# EAGLE design GPRS(A7) (EAGLE 7.6.0)
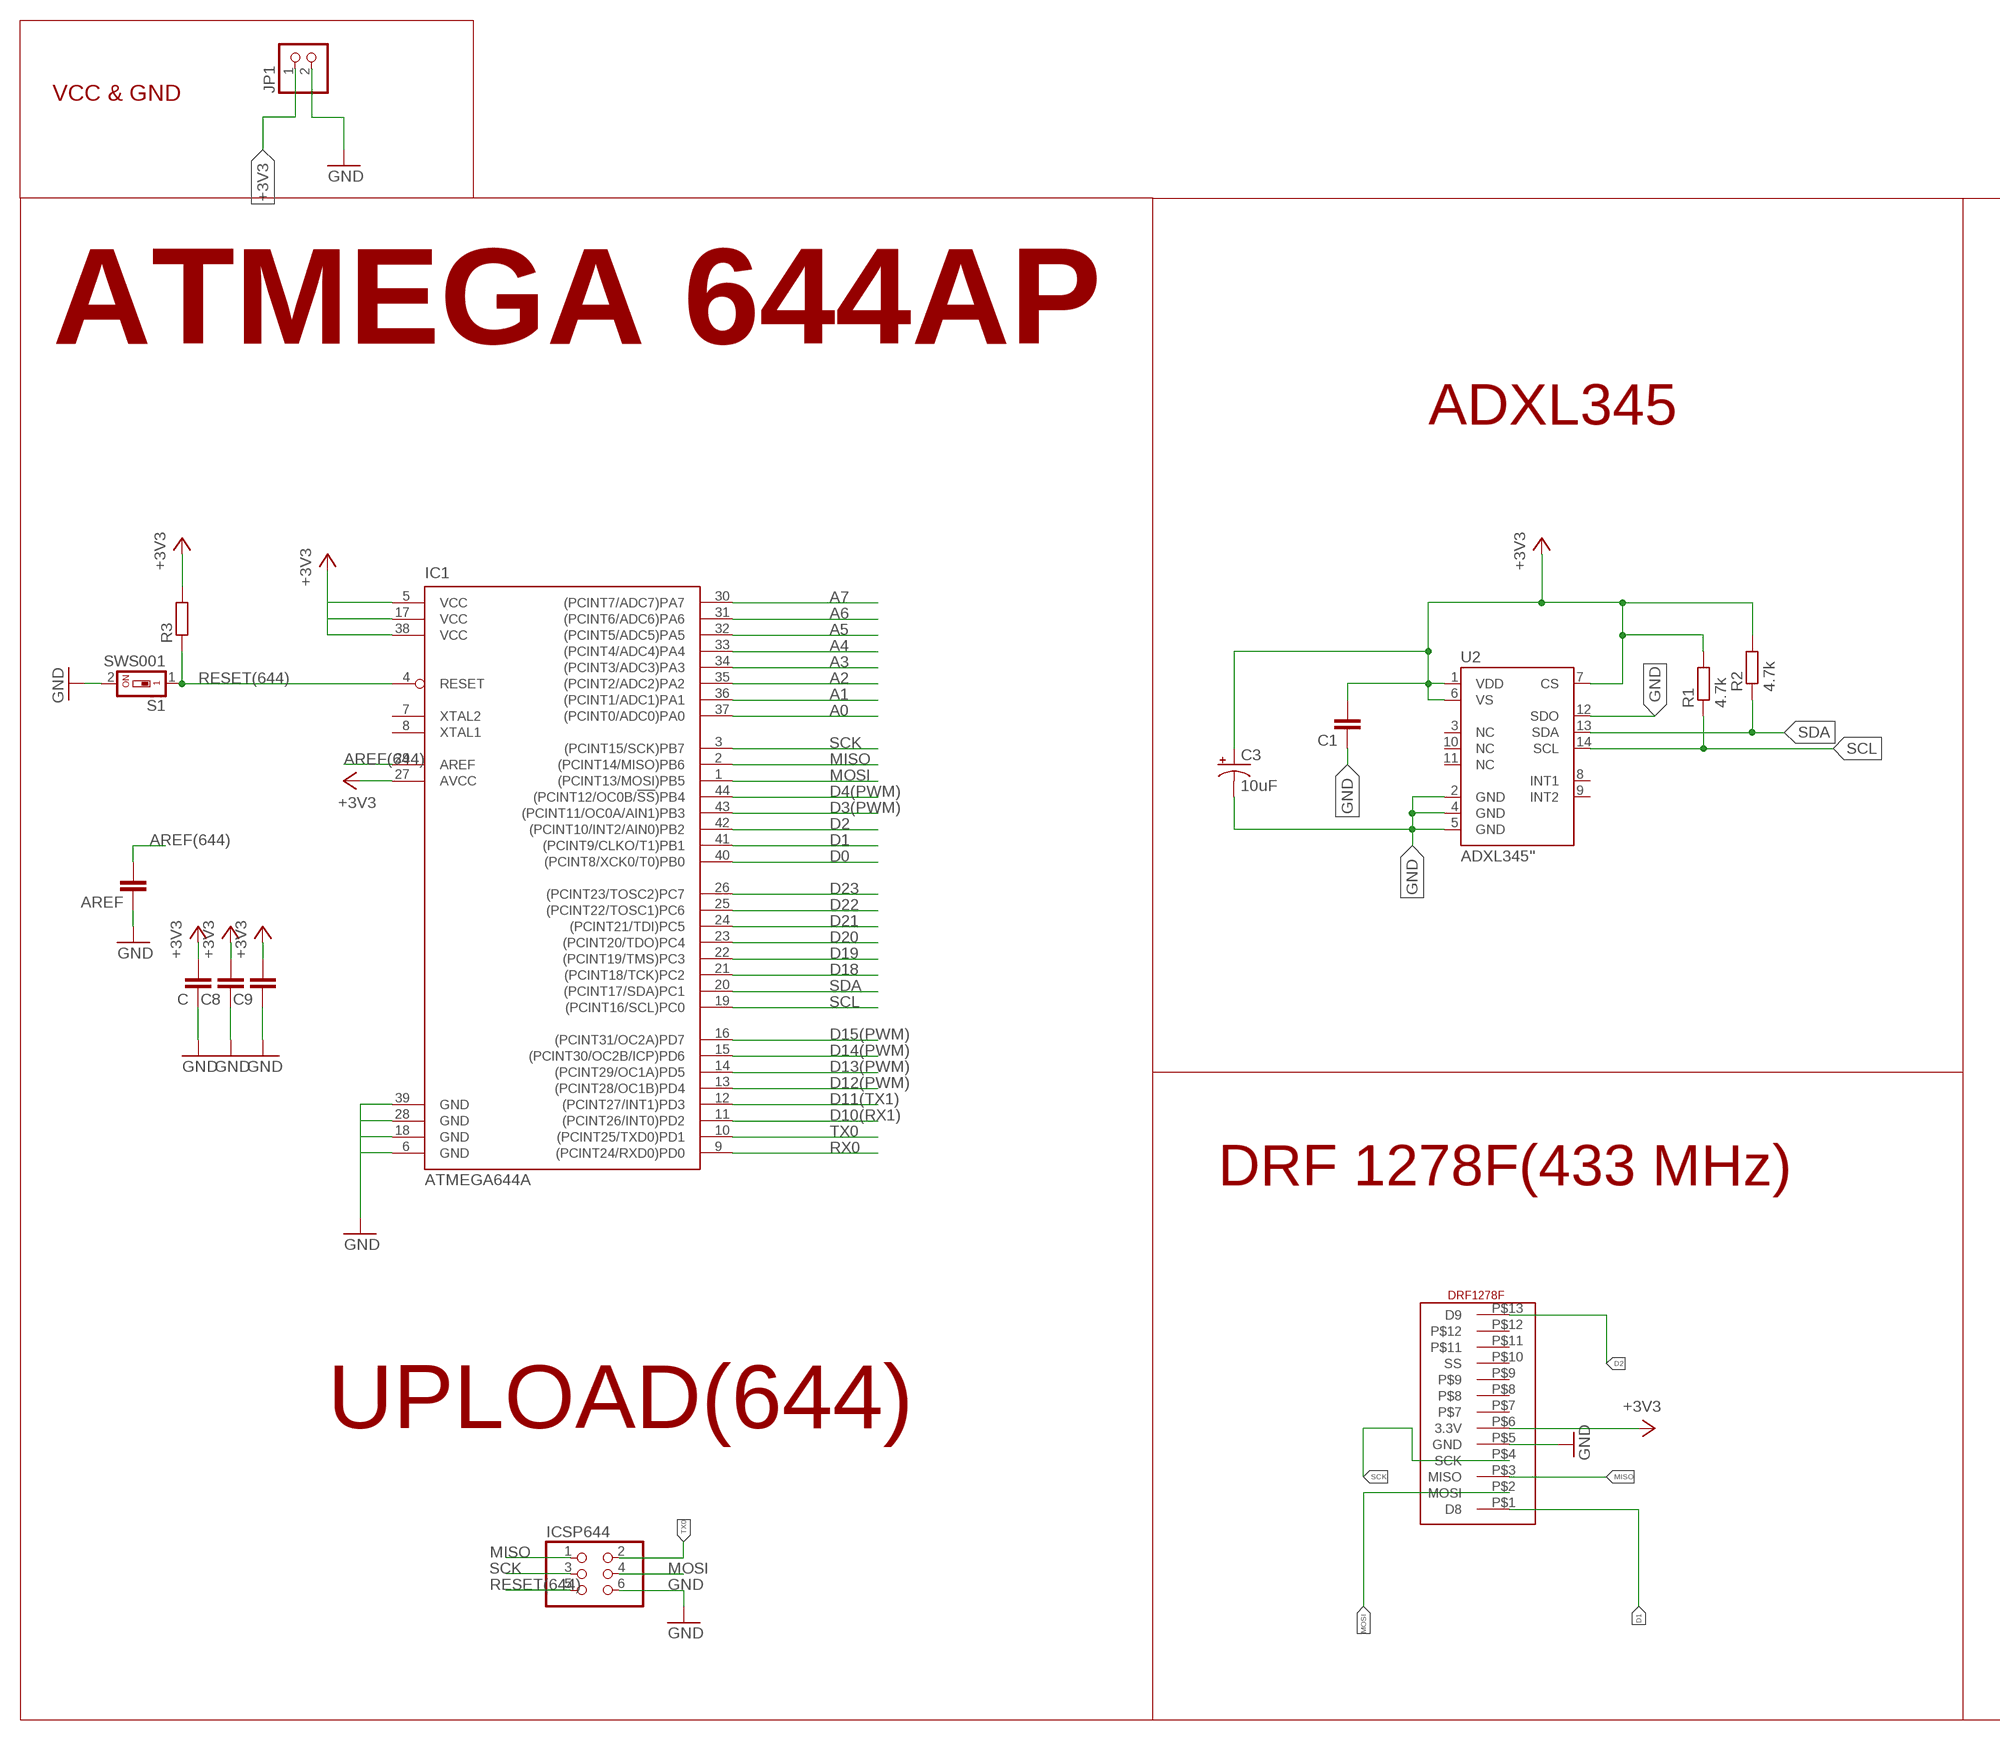
[diagram p0: schematic, sheet 1, part 1 of 2]
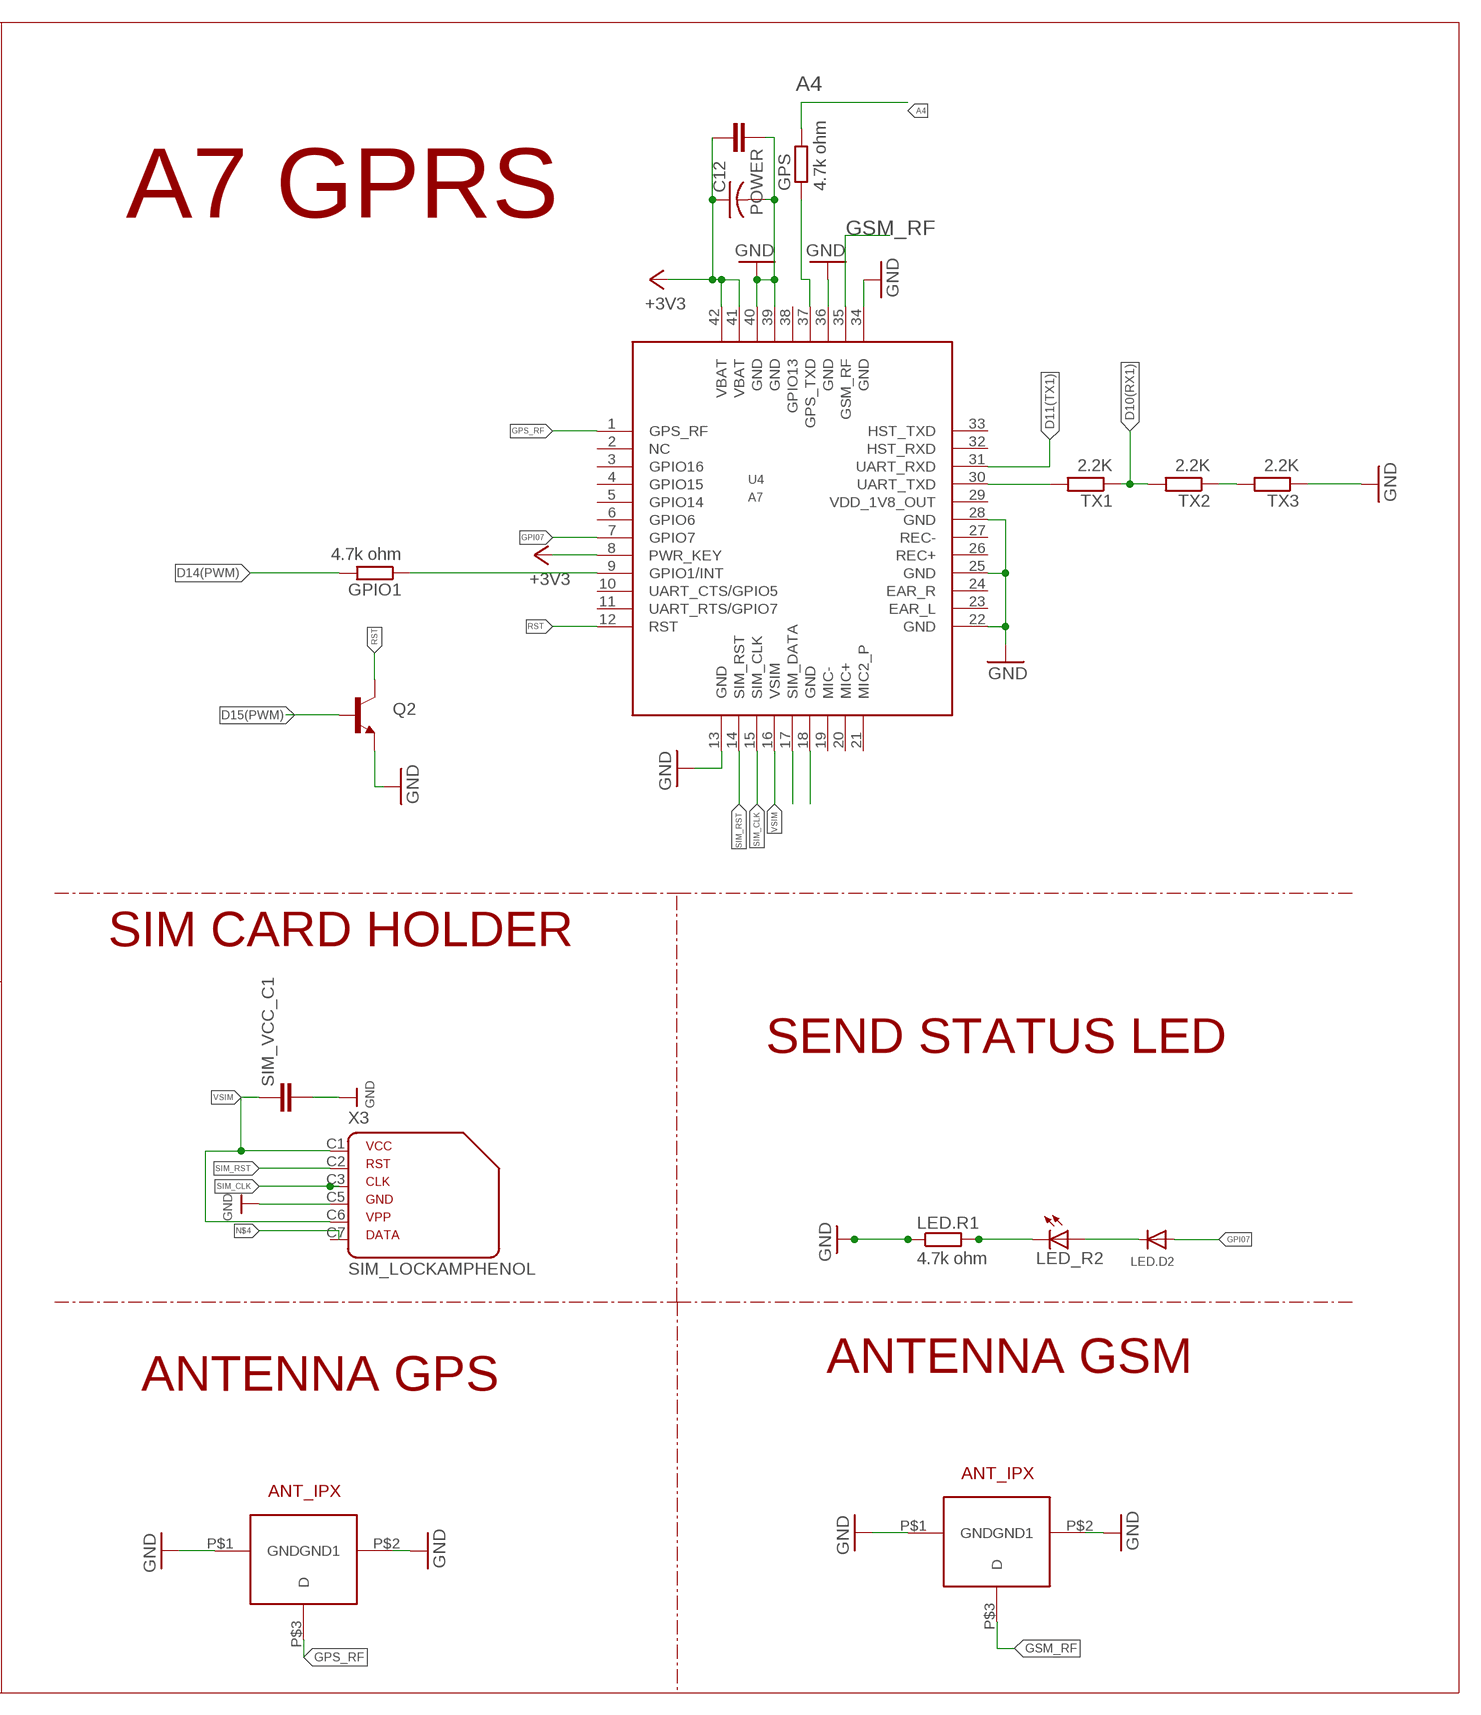
[diagram p1: schematic, sheet 1, part 2 of 2]

## Parts
AREF  100nF  C-EUC0805  [C0805]
C  22 uF  C-EUC0805  [C0805]
C1  0.1uF  C-EUC0805  [C0805]
C3  10uF  CAP_POL1206  [EIA3216]
C8  100nF  C-EUC0805  [C0805]
C9  100nF  C-EUC0805  [C0805]
C12  C-US025-024X044  [C025-024X044]
GPIO1  4.7k ohm  R-EU_R0805  [R0805]
GPS  4.7k ohm  R-EU_R0805  [R0805]
IC1  ATMEGA644A  [TQFP44]
ICSP644  PINHD-2X3  [2X03]
JP1  PINHD-1X2  [1X02]
LED.D2  DIODESOD-123  [SOD-123]
LED.R1  4.7k ohm  R-EU_R0805  [R0805]
LED_R2  LEDCHIP-LED0805  [CHIP-LED0805]
POWER  100nF  C-EUC0805  [C0805]
Q2  TRANSISTOR_NPNSOT23-3  [SOT23-3]
R1  4.7k  R-EU_R0805  [R0805]
R2  4.7k  R-EU_R0805  [R0805]
R3  R-EU_R0805  [R0805]
S1  SWS001  [SMS-001]
SIM_VCC_C1  100nF  C-EUC0805  [C0805]
TX1  2.2K  R-EU_R0805  [R0805]
TX2  2.2K  R-EU_R0805  [R0805]
TX3  2.2K  R-EU_R0805  [R0805]
U2  ADXL345"  [ADXL3451:1]
U4  A7  [A7]
U$1  DRF1278F  [DIP13]
U$2  ANTENNA_IPX  [SMD3]
U$9  ANTENNA_IPX  [SMD3]
X3  SIM_LOCKAMPHENOL  [C707_10M006_512_2]

## Nets
+3V3: C1.2 C3.A(+) C8.2 C9.2 C12.1 C.2 IC1.5(VCC) IC1.17(VCC) IC1.27(AVCC) IC1.38(VCC) JP1.1 POWER.2 R1.2 R2.2 R3.2 U2.1(VDD) U2.6(VS) U2.7(CS) U4.8(PWR_KEY) U4.41(VBAT) U4.42(VBAT) U$1.P$6(3.3V)
A0: IC1.37((PCINT0/ADC0)PA0)
A1: IC1.36((PCINT1/ADC1)PA1)
A2: IC1.35((PCINT2/ADC2)PA2)
A3: IC1.34((PCINT3/ADC3)PA3)
A4: GPS.2 IC1.33((PCINT4/ADC4)PA4)
A5: IC1.32((PCINT5/ADC5)PA5)
A6: IC1.31((PCINT6/ADC6)PA6)
A7: IC1.30((PCINT7/ADC7)PA7)
AREF(644): AREF.2 IC1.29(AREF)
D0: IC1.40((PCINT8/XCK0/T0)PB0)
D1: IC1.41((PCINT9/CLKO/T1)PB1) U$1.P$1(D8)
D2: IC1.42((PCINT10/INT2/AIN0)PB2) U$1.P$13(D9)
D3(PWM): IC1.43((PCINT11/OC0A/AIN1)PB3)
D4(PWM): IC1.44((PCINT12/OC0B/!SS!)PB4)
D10(RX1): IC1.11((PCINT26/INT0)PD2) TX1.1 TX2.2
D11(TX1): IC1.12((PCINT27/INT1)PD3) U4.31(UART_RXD)
D12(PWM): IC1.13((PCINT28/OC1B)PD4)
D13(PWM): IC1.14((PCINT29/OC1A)PD5)
D14(PWM): GPIO1.2 IC1.15((PCINT30/OC2B/ICP)PD6)
D15(PWM): IC1.16((PCINT31/OC2A)PD7) Q2.1(B)
D18: IC1.21((PCINT18/TCK)PC2)
D19: IC1.22((PCINT19/TMS)PC3)
D20: IC1.23((PCINT20/TDO)PC4)
D21: IC1.24((PCINT21/TDI)PC5)
D22: IC1.25((PCINT22/TOSC1)PC6)
D23: IC1.26((PCINT23/TOSC2)PC7)
GND: AREF.1 C1.1 C3.C(-) C8.1 C9.1 C12.2 C.1 IC1.6(GND) IC1.18(GND) IC1.28(GND) IC1.39(GND) ICSP644.6 JP1.2 LED.R1.1 POWER.1 Q2.2(E) S1.2 SIM_VCC_C1.2 TX3.1 U2.2(GND) U2.4(GND) U2.5(GND) U2.12(SDO) U4.13(GND) U4.22(GND) U4.25(GND) U4.28(GND) U4.34(GND) U4.36(GND) U4.39(GND) U4.40(GND) U$1.P$5(GND) U$2.P$1(GND) U$2.P$2(GND1) U$9.P$1(GND) U$9.P$2(GND1) X3.C5
GPI07: LED.D2.A U4.7(GPIO7)
GPS_RF: U4.1(GPS_RF) U$2.P$3(D)
GSM_RF: U4.35(GSM_RF) U$9.P$3(D)
MISO: IC1.2((PCINT14/MISO)PB6) ICSP644.1 U$1.P$3(MISO)
MOSI: IC1.1((PCINT13/MOSI)PB5) ICSP644.4 U$1.P$2(MOSI)
N$12: LED.R1.2 LED_R2.C
N$18: GPS.1 U4.37(GPS_TXD)
N$19: GPIO1.1 U4.9(GPIO1/INT)
N$21: U4.17(SIM_DATA)
N$22: U4.18(GND)
N$26: TX1.2 U4.30(UART_TXD)
N$31: TX2.1 TX3.2
PD1: LED.D2.C LED_R2.A
RESET(644): IC1.4(RESET) ICSP644.5 R3.1 S1.1
RST: Q2.3(C) U4.12(RST)
RX0: IC1.9((PCINT24/RXD0)PD0)
SCK: IC1.3((PCINT15/SCK)PB7) ICSP644.3 U$1.P$4(SCK)
SCL: IC1.19((PCINT16/SCL)PC0) R1.1 U2.14(SCL)
SDA: IC1.20((PCINT17/SDA)PC1) R2.1 U2.13(SDA)
SIM_CLK: U4.15(SIM_CLK) X3.C3
SIM_RST: U4.14(SIM_RST) X3.C2
TX0: IC1.10((PCINT25/TXD0)PD1) ICSP644.2
VSIM: SIM_VCC_C1.1 U4.16(VSIM) X3.C1 X3.C6
Unconnected: IC1.7(XTAL2) IC1.8(XTAL1) U2.3(NC) U2.8(INT1) U2.9(INT2) U2.10(NC) U2.11(NC) U4.2(NC) U4.3(GPIO16) U4.4(GPIO15) U4.5(GPIO14) U4.6(GPIO6) U4.10(UART_CTS/GPIO5) U4.11(UART_RTS/GPIO7) U4.19(MIC-) U4.20(MIC+) U4.21(MIC2_P) U4.23(EAR_L) U4.24(EAR_R) U4.26(REC+) U4.27(REC-) U4.29(VDD_1V8_OUT) U4.32(HST_RXD) U4.33(HST_TXD) U4.38(GPIO13) U$1.P$7 U$1.P$8 U$1.P$9 U$1.P$10(SS) U$1.P$11 U$1.P$12 X3.C7

## Notes on the sheet
- VCC & GND
- ATMEGA 644AP
- A7 GPRS
- ADXL345
- SIM CARD HOLDER
- SEND STATUS LED
- DRF 1278F(433 MHz)
- ANTENNA GSM
- ANTENNA GPS
- UPLOAD(644)

## Library data of the parts
AREF C C1 C8 C9 POWER SIM_VCC_C1 = rcl:C-EU: CAPACITOR, European symbol
C3 = SparkFun:CAP_POL: Capacitor Polarized These are standard SMD and PTH capacitors. Normally 10uF, 47uF, and 100uF in electrolytic and tantalum varieties. Always verify the external diameter of the through hole cap, it varies with capacity, voltage, and manufacturer. The EIA devices should be standard.
C12 = rcl:C-US: CAPACITOR, American symbol
GPIO1 GPS LED.R1 R1-R3 TX1-TX3 = resistor:R-EU_: RESISTOR, European symbol
IC1 = atmel:ATMEGA644: 8-bit Microcontroller with 64K Bytes In-System Programmable Flash Source: http://www.atmel.com/dyn/resources/prod_documents/doc2593.pdf; MPN: ATMEGA644PV-10AU; OC_FARNELL: 1455123; OC_NEWARK: 58M3748
ICSP644 = pinhead:PINHD-2X3: PIN HEADER
JP1 = pinhead:PINHD-1X2: PIN HEADER
LED.D2 = adafruit:DIODE: Diode SMADIODE - SMA Surface Mount Package 20V 1A Schottky Diode Digikey: 641-1014-6-ND DO-1N4148 - Through Hole Small Current Diode SOD-123 20V 1 A (.5mV Vf) Schottky Diode - Digikey: MBRX120TPMSCT-ND SOD-323 10V 570mA (.38mV Vf, 3ns) Schottky Diode - Digikey: ZLLS410CT-ND SOD-523 30V 30mA Schottky Diode (RB751S-40TE61) - Digikey: RB751S-40TE61CT-ND SOT23-R/W - SOT23 Package (R = Solder Paste/Reflow Ovens, W = Hand-Soldering) BAT54Film 40V 300mA - Digikey: 497-7162-1-ND
LED_R2 = adafruit:LED: LED OSRAM: - CHIPLED LG R971, LG N971, LY N971, LG Q971, LY Q971, LO R971, LY R971 LH N974, LH R974 LS Q976, LO Q976, LY Q976 LO Q996 - Hyper CHIPLED LW Q18S LB Q993, LB Q99A, LB R99A - SideLED LS A670, LO A670, LY A670, LG A670, LP A670 LB A673, LV A673, LT A673, LW A673 LH A674 LY A675 LS A676, LA A676, LO A676, LY A676, LW A676 LS A679, LY A679, LG A679 - Hyper Micro SIDELED® LS Y876, LA Y876, LO Y876, LY Y876 LT Y87S - SmartLED LW L88C, LW L88S LB L89C, LB L89S, LG L890 LS L89K, LO L89K, LY L89K LS L896, LA L896, LO L896, LY L896 - TOPLED LS T670, LO T670, LY T670, LG T670, LP T670 LSG T670, LSP T670, LSY T670, LOP T670, LYG T670 LG T671, LOG T671, LSG T671 LB T673, LV T673, LT T673, LW T673 LH T674 LS T676, LA T676, LO T676, LY T676, LB T676, LH T676, LSB T676, LW T676 LB T67C, LV T67C, LT T67C, LS T67K, LO T67K, LY T67K, LW E67C LS E67B, LA E67B, LO E67B, LY E67B, LB E67C, LV E67C, LT E67C LW T67C LS T679, LY T679, LG T679 LS T770, LO T770, LY T770, LG T770, LP T770 LB T773, LV T773, LT T773, LW T773 LH T774 LS E675, LA E675, LY E675, LS T675 LS T776, LA T776, LO T776, LY T776, LB T776 LHGB T686 LT T68C, LB T68C - Hyper Mini TOPLED® LB M676 - Mini TOPLED Santana® LG M470 LS M47K, LO M47K, LY M47K Source: http://www.osram.convergy.de/
Q2 = SparkFun:TRANSISTOR_NPN: Transistor NPN BJT configuration in SOT23 package. MMBT2222 is the common NPN we use. Double check BCE configuration again layout.
S1 = smd-special:SWS001: SMD Dip Switch 1 pol.
U2 = SparkFun-Sensors:ADXL345: 3-axis SPI/I2C 2/4/8/16g accelerometer; PROD_ID: IC-09097
U4 = IC:A7
U$1 = small_header:DRF1278F
U$2 U$9 = MOSHE_IPX5:ANTENNA_IPX
X3 = microbuilder:SIM_LOCK: C707A SIMLOCK® 2.5 mm with wide solder tails Source: Data sheet <http://www.amphenol.info/downloads/C707_10M006_512_2.pdf>; OC_FARNELL: unknown; OC_NEWARK: unknown

## Board
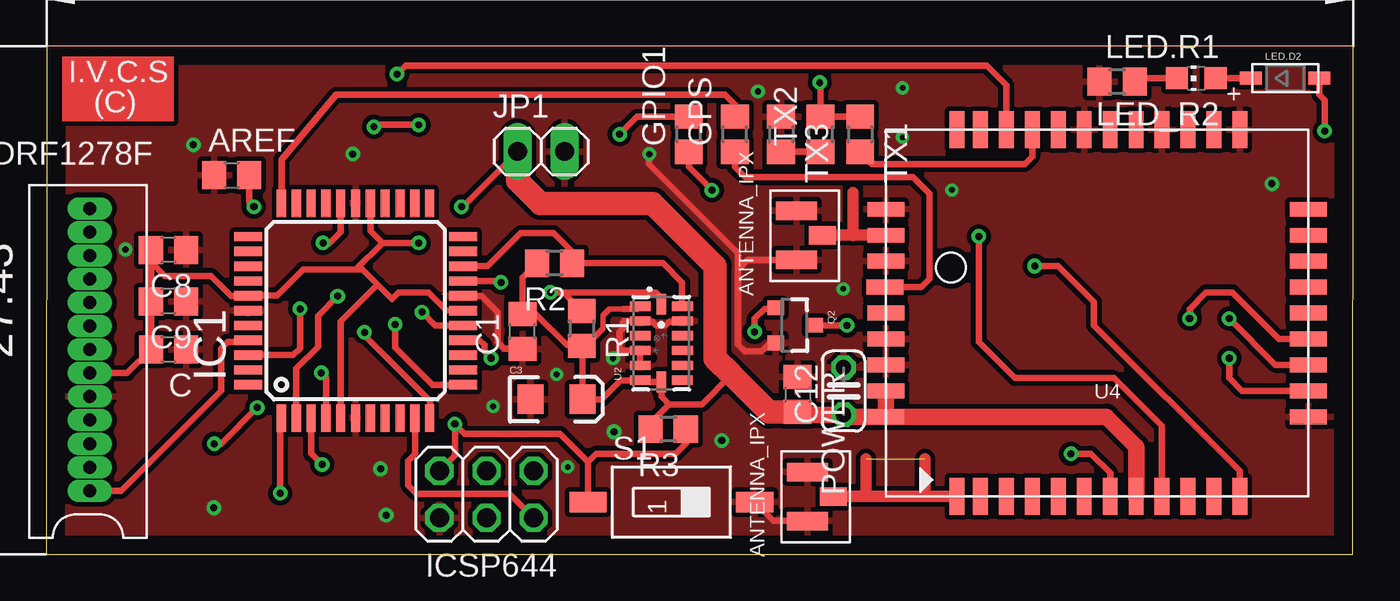
[diagram p2: board, top side]
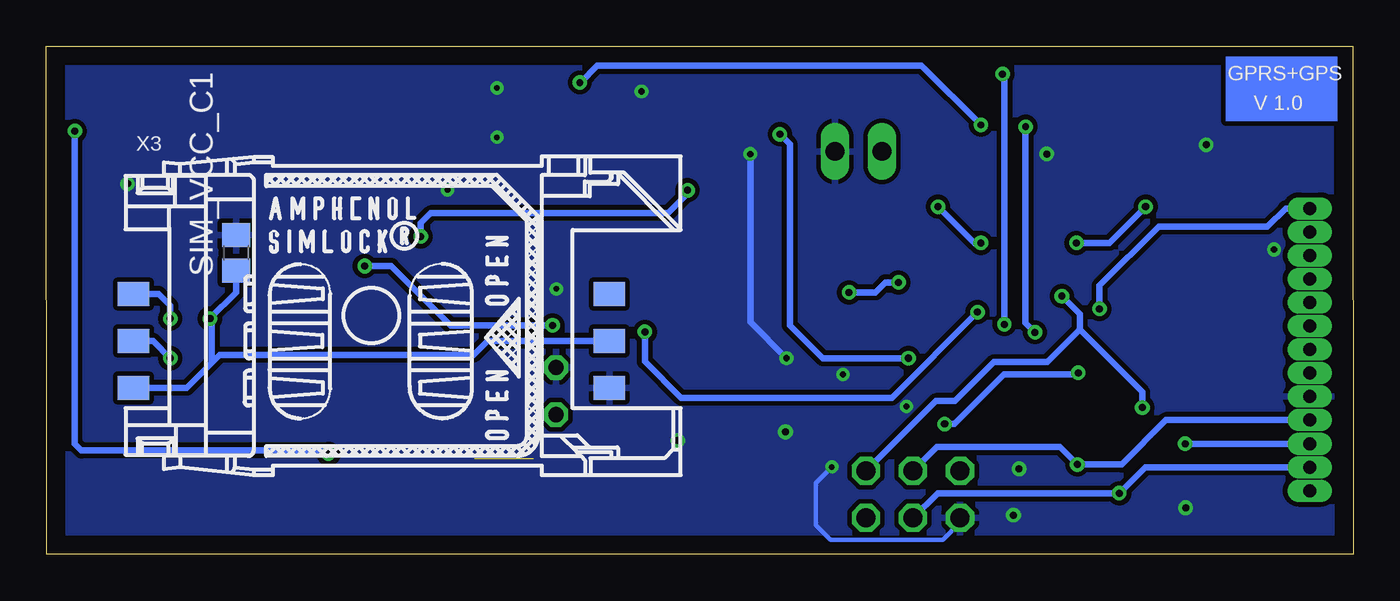
[diagram p3: board, bottom side, seen from below]

Size 70.53 x 27.43 mm. Coordinates in mm from the lower left corner, seen from the top.
Outline: 0,0 70.5,0 70.53,27.43 0.03,27.43 0,0
Copper layers (1*16): Top 0.035mm / dielectric 1.5mm / Bottom 0.035mm
Design rules "default *": minimum track width 10mil, minimum drill 11mil, track to track 7mil, track to pad 7mil, pad to pad 7mil, via to via 7mil, smd to smd 7mil, copper to edge 40mil, drill to drill 8mil, minimum pad ring 10mil, minimum via ring 8mil, stop-mask expansion 4mil, vias tented up to drill 0mil, thermal gap 10mil

### Footprints (pad centres in the part's own frame; a part is rotated, then mirrored left to right if it is on the bottom)
C0805 = smd 1.3 x 1.5: 1 -0.95,0; 2 0.95,0
EIA3216 = smd 1.4 x 1.6: A 1.4,0; C -1.4,0
C025-024X044 = drill 0.813 octagon: 1 -1.27,0; 2 1.27,0
R0805 = smd 1.3 x 1.5: 1 -0.95,0; 2 0.95,0
TQFP44 = smd 1.5 x 0.5: 1 -5.8,4; 2 -5.8,3.2; 3 -5.8,2.4; 4 -5.8,1.6; 5 -5.8,0.8; 6 -5.8,0; 7 -5.8,-0.8; 8 -5.8,-1.6; 9 -5.8,-2.4; 10 -5.8,-3.2; 11 -5.8,-4; 23 5.8,-4; 24 5.8,-3.2; 25 5.8,-2.4; 26 5.8,-1.6; 27 5.8,-0.8; 28 5.8,0; 29 5.8,0.8; 30 5.8,1.6; 31 5.8,2.4; 32 5.8,3.2; 33 5.8,4 | smd 0.5 x 1.5: 12 -4,-5.8; 13 -3.2,-5.8; 14 -2.4,-5.8; 15 -1.6,-5.8; 16 -0.8,-5.8; 17 0,-5.8; 18 0.8,-5.8; 19 1.6,-5.8; 20 2.4,-5.8; 21 3.2,-5.8; 22 4,-5.8; 34 4,5.8; 35 3.2,5.8; 36 2.4,5.8; 37 1.6,5.8; 38 0.8,5.8; 39 0,5.8; 40 -0.8,5.8; 41 -1.6,5.8; 42 -2.4,5.8; 43 -3.2,5.8; 44 -4,5.8
2X03 = drill 1.016 octagon: 1 -2.54,-1.27; 2 -2.54,1.27; 3 0,-1.27; 4 0,1.27; 5 2.54,-1.27; 6 2.54,1.27
1X02 = drill 1.016 long: 1 -1.27,0; 2 1.27,0
SOD-123 = smd 1.2 x 0.7: A 1.85,0; C -1.85,0
CHIP-LED0805 = smd 1.2 x 1.2: A 0,-1.05; C 0,1.05
SOT23-3 = smd 0.8 x 0.9: 1 -0.95,-1; 2 0.95,-1; 3 0,1.1
SMS-001 = smd 1.092 x 2.007: 1 0,-4.496; 2 0,4.496
ADXL3451:1 = smd 0.5 x 1.124: 1 2,1.138; 2 1.2,1.138; 3 0.4,1.138; 4 -0.4,1.138; 5 -1.2,1.138; 6 -2,1.138; 8 -2,-1.13; 9 -1.2,-1.138; 10 -0.4,-1.138; 11 0.4,-1.138; 12 1.2,-1.138; 13 2,-1.138 | smd 1.124 x 0.5: 7 -2.1,0; 14 2.1,0
A7 = smd 0.8 x 2: 1 7.57,9.9; 2 6.3,9.9; 3 4.9,9.9; 4 3.5,9.9; 5 2.1,9.9; 6 0.7,9.9; 7 -0.7,9.9; 8 -2.1,9.9; 9 -3.5,9.9; 10 -4.9,9.9; 11 -6.3,9.9; 12 -7.7,9.9; 22 -7.7,-9.9; 23 -6.3,-9.9; 24 -4.9,-9.9; 25 -3.5,-9.9; 26 -2.1,-9.9; 27 -0.7,-9.9; 28 0.7,-9.9; 29 2.1,-9.9; 30 3.5,-9.9; 31 4.9,-9.9; 32 6.3,-9.9; 33 7.57,-9.9 | smd 2 x 0.8: 13 -11.4,5.6; 14 -11.4,4.2; 15 -11.4,2.8; 16 -11.4,1.4; 17 -11.4,0; 18 -11.4,-1.4; 19 -11.4,-2.8; 20 -11.4,-4.2; 21 -11.4,-5.6; 34 11.4,-5.6; 35 11.4,-4.2; 36 11.4,-2.8; 37 11.46,-1.4; 38 11.4,0; 39 11.4,1.4; 40 11.4,2.8; 41 11.4,4.2; 42 11.4,5.6
DIP13 = drill 0.7 long: P$1 -2,0; P$2 -2,-1.27; P$3 -2,-2.54; P$4 -2,-3.81; P$5 -2,-5.08; P$6 -2,-6.35; P$7 -2,-7.62; P$8 -2,-8.89; P$9 -2,-10.16; P$10 -2,-11.43; P$11 -2,-12.7; P$12 -2,-13.97; P$13 -2,-15.24
SMD3 = smd 1 x 2.2: P$1 -1.55,0; P$2 1.1,0 | smd 1 x 1.45: P$3 -0.22,-1.4
C707_10M006_512_2 = smd 1.7 x 1.3: C1 -12.85,-3.915; C2 -12.85,-1.375; C3 -12.85,1.165; C5 12.85,-3.915; C6 12.85,-1.375; C7 12.85,1.165

### Placement (x,y rotation side)
AREF  10,20.47 0 top
C  6.6,11.06 180 top
C1  25.69,12.03 90 top
C3  27.53,8.38 0 top
C8  6.6,16.43 180 top
C9  6.6,13.66 180 top
C12  43.03,8.81 90 top
GPIO1  34.67,22.68 90 top
GPS  37.16,22.68 90 top
IC1  16.69,13.16 90 top
ICSP644  23.76,3.24 180 top
JP1  26.7,21.76 0 top
LED.D2  66.85,25.7 0 top
LED.R1  57.78,25.53 0 top
LED_R2  62.05,25.7 90 top
POWER  40.54,8.64 270 top
Q2  40.36,12.37 270 top
R1  28.9,12.2 270 top
R2  27.42,15.72 180 top
R3  33.56,6.76 180 top
S1  33.73,2.83 270 top
SIM_VCC_C1  60.27,16.28 90 bottom
TX1  43.92,22.68 270 top
TX2  41.78,22.68 90 top
TX3  39.65,22.68 270 top
U2  33.19,11.4 90 top
U4  56.71,13.03 180 top
U$1  0.34,3.44 180 top
U$2  41.07,3.35 90 top
U$9  40.48,17.45 90 top
X3  52.98,12.9 0 bottom

### Tracks (layer width: path | path; a pad name or v marks a point on that pad's centre or on a via)
+3V3  (via drill 0.38)
  Top 0.305: R1.2 29.11,11.25 30.05,12.19 30.05,12.9 30.4,13.26 31.11,13.26
  Top 0.356: v20.09,16.82 18.14,16.82 | 18.14,16.82 17.49,17.46 IC1.27 | U$1.P$6 4.38,9.79 C.2 C9.2 C8.2 5.65,15.79 6.4,15.04 8.89,15.04 9.97,13.96 IC1.38 12.45,13.97 13.86,15.38 16.7,15.38 | R3.2 32.61,7.11 33.6,8.1 | v22.4,18.77 22.44,18.73 25.43,21.72 JP1.1 | 16.7,15.38 18.14,16.82 | 33.6,8.1 35.38,8.1 36.98,9.7 | IC1.17 21.61,13.16 20.62,14.15 19.02,14.15 18.67,13.79 17.88,14.58 | 16.7,15.38 17.08,15.38 17.88,14.58 | IC1.5 15.89,12.59 17.88,14.58 | R2.2 25.69,14.94 C1.2 26.41,12.98 28.09,11.3 28.84,11.3 R1.2 28.93,11.21 C3.A 29.97,8.38 30.99,9.4 U2.6 32.15,9.3 U2.7 33.19,8.52 33.6,8.1 | 31.11,13.26 31.9,13.26 U2.1
  Top 0.889: POWER.2 40.68,7.54 C12.1 43.14,7.43 U4.42 | U4.42 U4.41 | U4.42 57.21,7.43 58.83,5.82 58.83,3.15 U4.8
  Top 1.27: JP1.1 25.43,20.19 26.67,18.95 32.72,18.95 36.09,15.57 36.09,10.59 36.98,9.7 39,7.69 POWER.2
  Bottom 0.356: v20.09,16.82 20.45,16.82 v22.4,18.77
A4
  Top 0.356: IC1.33 12.69,21.32 15.65,24.82 36.63,24.82 37.16,24.28 GPS.2
AREF(644)  (via drill 0.38)
  Top 0.356: IC1.29 15.89,17.41 15.29,16.82 v14.94,16.82 | v11.2,18.77 10.95,19.02 AREF.2
  Bottom 0.356: v11.2,18.77 13.16,16.82 v14.94,16.82
D1
  Top 0.356: U$1.P$1 4.05,3.44 9.42,8.81 9.42,11.12 9.78,11.48 10.81,11.48 IC1.41
D2  (via drill 0.38)
  Top 0.356: IC1.42 13.32,10.76 13.69,11.12 v13.69,13.26
  Bottom 0.356: U$1.P$13 3.65,18.68 4.62,17.7 10.49,17.7 13.69,14.5 v13.69,13.26
D10(RX1)  (via drill 0.37)
  Top 0.356: TX1.1 TX2.2 41.78,25.43 v41.73,25.48 | v20.09,23.19 17.78,23.19 v17.68,23.09 | v17.17,11.99 17.17,11.81 20.7,8.28 20.7,7.37 IC1.11
  Bottom 0.356: v41.73,25.48 41.71,25.48 40.79,26.39 23.29,26.39 v20.09,23.19 | v17.68,23.09 17.68,12.5 v17.17,11.99
D11(TX1)  (via drill 0.37)
  Top 0.356: U4.31 51.81,25.33 50.75,26.39 19.38,26.39 v18.92,25.93 | v18.82,12.42 18.82,11.18 20.85,9.14 22.47,9.14 IC1.12
  Bottom 0.356: v18.92,25.93 18.82,25.83 v18.82,12.42
D14(PWM)  (via drill 0.38)
  Top 0.356: IC1.15 23.39,11.56 23.65,11.3 23.65,10.95 v24,10.59 | 34.61,23.57 GPIO1.2 31.89,23.63 v30.94,22.68
  Bottom 0.356: v24,10.59 28.63,10.59 30.4,12.37 30.4,22.15 v30.94,22.68
D15(PWM)  (via drill 0.38)
  Top 0.356: IC1.16 20.99,12.36 v20.27,13.08 | v38.23,12.01 38.23,12.72 38.76,13.26 39.3,13.26 Q2.1
  Bottom 0.356: v20.27,13.08 24.89,8.46 36.27,8.46 38.23,10.41 v38.23,12.01
GND  (via drill 0.3, 0.33, 0.38)
  Top 0.33: U2.12 34.27,12.55 33.6,12.55 33.43,12.37 32.89,12.37 32.72,12.55 32.54,12.55 32.48,12.6 U2.2
  Top 0.356: IC1.18 23.48,13.96 24.36,13.08 24.36,11.48 24.71,11.12 25.65,11.12 C1.1 | 39.05,11.42 38.58,10.95 37.69,10.95 37.34,11.3 37.34,15.39 | 37.34,15.39 37.34,16.28 32.54,21.08 v32.54,21.61 | U$2.P$1 39.25,1.8 S1.2 | U$9.P$1 37.85,15.9 37.34,15.39 | U2.2 31.17,12.6 31.11,12.55 31.11,12.19 30.94,12.01 30.94,10.95 | 30.94,10.95 v30.58,10.59 | 30.94,10.95 30.99,11 U2.4 U2.5
  Bottom 0.254: ICSP644.6 21.22,1.72 22.15,0.79 28.22,0.79 28.99,1.56 28.99,3.86 v28.14,4.71
  Bottom 0.356: v30.58,10.59 32.54,12.55 v32.54,21.61
  other vias: 4.27,16.46 36.45,6.15 66.14,20.02 16.54,21.62 38.4,24.99 7.94,22.12 30.64,6.62 18.34,2.12 18.04,4.62 9.04,2.52 27.54,9.72 24.11,7.99 46.2,25.18 46.2,22.52 48.87,19.67 43,14.34
  pour Top (isolate 0.254): 0.36,27.17 0.53,0.06 70.49,0.06 70.49,27.35
  pour Bottom (isolate 0.254): 0.36,27.26 70.44,27.39 70.44,0.1 0.18,-0.02
GPI07  (via drill 0.38)
  Top 0.356: 57.6,3.49 U4.7 57.41,4.39 56.36,5.44 v55.3,5.44 | v68.99,22.86 68.99,24.53 68.7,24.82 LED.D2.A
  Bottom 0.356: v68.99,22.86 68.99,5.97 68.63,5.61 55.47,5.61 v55.3,5.44
GPS_RF
  Top 0.61: U$2.P$3 48.51,3.13 U4.1
GSM_RF
  Top 0.61: U4.35 U$9.P$3
MISO  (via drill 0.38)
  Top 0.356: v9.07,5.97 9.42,5.97 v11.38,7.92 | IC1.2 13.49,10.03 14.66,11.2 14.66,12.88 v15.72,13.95
  Bottom 0.356: U$1.P$3 9.06,5.98 v9.07,5.97 | ICSP644.1 22.52,8.28 21.49,8.28 19.38,10.39 16.51,10.39 14.76,12.14 | v11.38,7.92 11.38,8.76 14.76,12.14 | 14.76,12.14 14.76,12.98 v15.72,13.95
MOSI  (via drill 0.38)
  Top 0.356: v12.62,3.3 12.62,7.29 IC1.1
  Bottom 0.356: ICSP644.4 22.42,3.3 v12.62,3.3 11.22,4.71 U$1.P$2
N$3  (1 unrouted)
  Top 0.61: 44.22,5.15 44.22,3.13 | 47.42,5.15 47.42,3.13
N$5
  Top 0.61: 43.54,17.23 43.54,19.53
N$12
  Top 0.356: LED.R1.2 58.91,25.7 LED_R2.C
N$18
  Top 0.356: GPS.1 37.16,20.9 37.69,20.37 46.76,20.37 47.65,19.48 47.65,14.86 47.22,14.43 U4.37
N$19  (via drill 0.38)
  Top 0.356: v50.32,17.17 50.32,11.48 52.27,9.53 57.61,9.53 60.21,6.92 U4.9 | GPIO1.1 34.67,20.9 v35.92,19.66
  Bottom 0.356: v50.32,17.17 50.32,17.88 49.78,18.41 36.98,18.41 35.92,19.48 v35.92,19.66
N$26
  Top 0.356: U4.30 53.21,21.48 52.81,21.08 44.57,21.08 TX1.2
N$31
  Top 0.356: TX3.2 TX2.1
PD1
  Top 0.356: LED_R2.A LED.D2.C
RESET(644)  (via drill 0.38)
  Top 0.356: S1.1 29.24,5 | 29.24,5 27.74,6.5 22.58,6.5 v22.05,7.04 22.05,5.34 ICSP644.5 | 15.11,7.38 IC1.4 15.09,9.55 v14.83,9.8 | R3.1 34.51,5.99 33.96,5.44 29.67,5.44 29.24,5
  Bottom 0.356: v22.05,7.04 21.51,7.04 18.85,9.7 14.94,9.7 v14.83,9.8
RST  (via drill 0.38)
  Top 0.356: Q2.3 v43.2,12.37 | U4.12 64.41,4.5 56.54,12.37 56.54,13.61 54.59,15.57 v53.34,15.57
  Bottom 0.356: v43.2,12.37 48.72,12.37 51.92,15.57 v53.34,15.57
SCK  (via drill 0.38)
  Top 0.356: IC1.3 14.29,5.45 v14.88,4.85
  Bottom 0.356: ICSP644.3 22.47,5.79 15.82,5.79 v14.88,4.85 12.5,4.85 10.1,7.25 U$1.P$4
SCL  (via drill 0.38)
  Top 0.356: R1.1 27.9,14.15 | 27.9,14.15 v27.2,14.15 | U2.14 33.19,13.85 32.89,14.15 27.9,14.15 | IC1.19 24.46,14.76 v24.54,14.68
  Bottom 0.356: v24.54,14.68 25.25,14.68 25.78,14.15 v27.2,14.15
SDA
  Top 0.356: U2.13 34.31,13.41 34.31,14.68 33.28,15.72 R2.1 28.37,16.36 27.38,17.35 25.6,17.35 23.81,15.56 IC1.20
SIM_CLK  (via drill 0.38)
  Top 0.356: v63.83,12.72 66.33,10.23 U4.15
  Bottom 0.356: v63.83,12.72 63.83,13.44 64.46,14.07 X3.C3
SIM_RST  (via drill 0.38)
  Top 0.356: v63.83,10.59 63.83,9.53 64.52,8.83 U4.14
  Bottom 0.356: X3.C2 64.77,11.53 v63.83,10.59
TX0
  Top 0.356: ICSP644.2 24.99,3.28 19.99,3.28 19.53,3.73 19.53,5.05 19.91,5.44 19.91,7.33 IC1.10
VSIM  (via drill 0.38)
  Top 0.356: v61.7,12.72 61.7,13.26 62.59,14.15 64.01,14.15 66.53,11.63 U4.16
  Bottom 0.356: X3.C6 46.71,11.53 47.47,10.77 61.16,10.77 61.61,10.32 | 61.61,10.32 62.94,8.99 X3.C1 | 61.61,10.32 61.61,12.64 v61.7,12.72 60.27,14.15 SIM_VCC_C1.1
(copper drawn outside any net)
  shapes: Bottom area x1, Top area x1

### Text on the board
tPlace: I.V.C.S | (C)
bPlace: GPRS+GPS | V 1.0